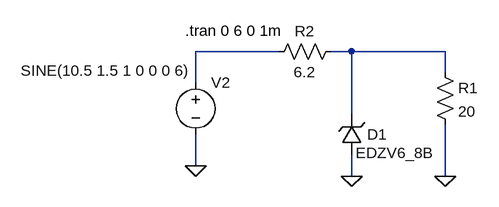
[diagram p0: schematic fuebte_zener.asc]
fuebte_zener.asc, the LTspice schematic file:
Version 4
SHEET 1 880 680
WIRE -48 16 -176 16
WIRE 64 16 32 16
WIRE 208 16 64 16
WIRE 208 48 208 16
WIRE -176 64 -176 16
WIRE 64 112 64 16
WIRE -176 192 -176 144
WIRE 64 208 64 176
WIRE 208 208 208 128
FLAG 64 208 0
FLAG 208 208 0
FLAG -176 192 0
SYMBOL zener 80 176 R180
WINDOW 0 -39 32 Left 2
WINDOW 3 -110 4 Left 2
SYMATTR InstName D1
SYMATTR Value EDZV6_8B
SYMBOL res 192 32 R0
SYMATTR InstName R1
SYMATTR Value 20
SYMBOL voltage -176 48 R0
WINDOW 3 -269 -3 Left 2
WINDOW 123 0 0 Left 0
WINDOW 39 0 0 Left 0
SYMATTR Value SINE(10.5 1.5 1 0 0 0 6)
SYMATTR InstName V2
SYMBOL res 48 0 R90
WINDOW 0 0 56 VBottom 2
WINDOW 3 32 56 VTop 2
SYMATTR InstName R2
SYMATTR Value 6.2
TEXT -192 -16 Left 2 !.tran 0 6 0 1m

The netlist it stands for:
* fuebte_zener.asc
D1 0 N002 EDZV6_8B
R1 N002 0 20
V2 N001 0 SINE(10.5 1.5 1 0 0 0 6)
R2 N002 N001 6.2
.model D D
.lib standard.dio
.tran 0 6 0 1m
.backanno
.end